# EAGLE design Adafruit AMG8833 FeatherWing (EAGLE 6.4)
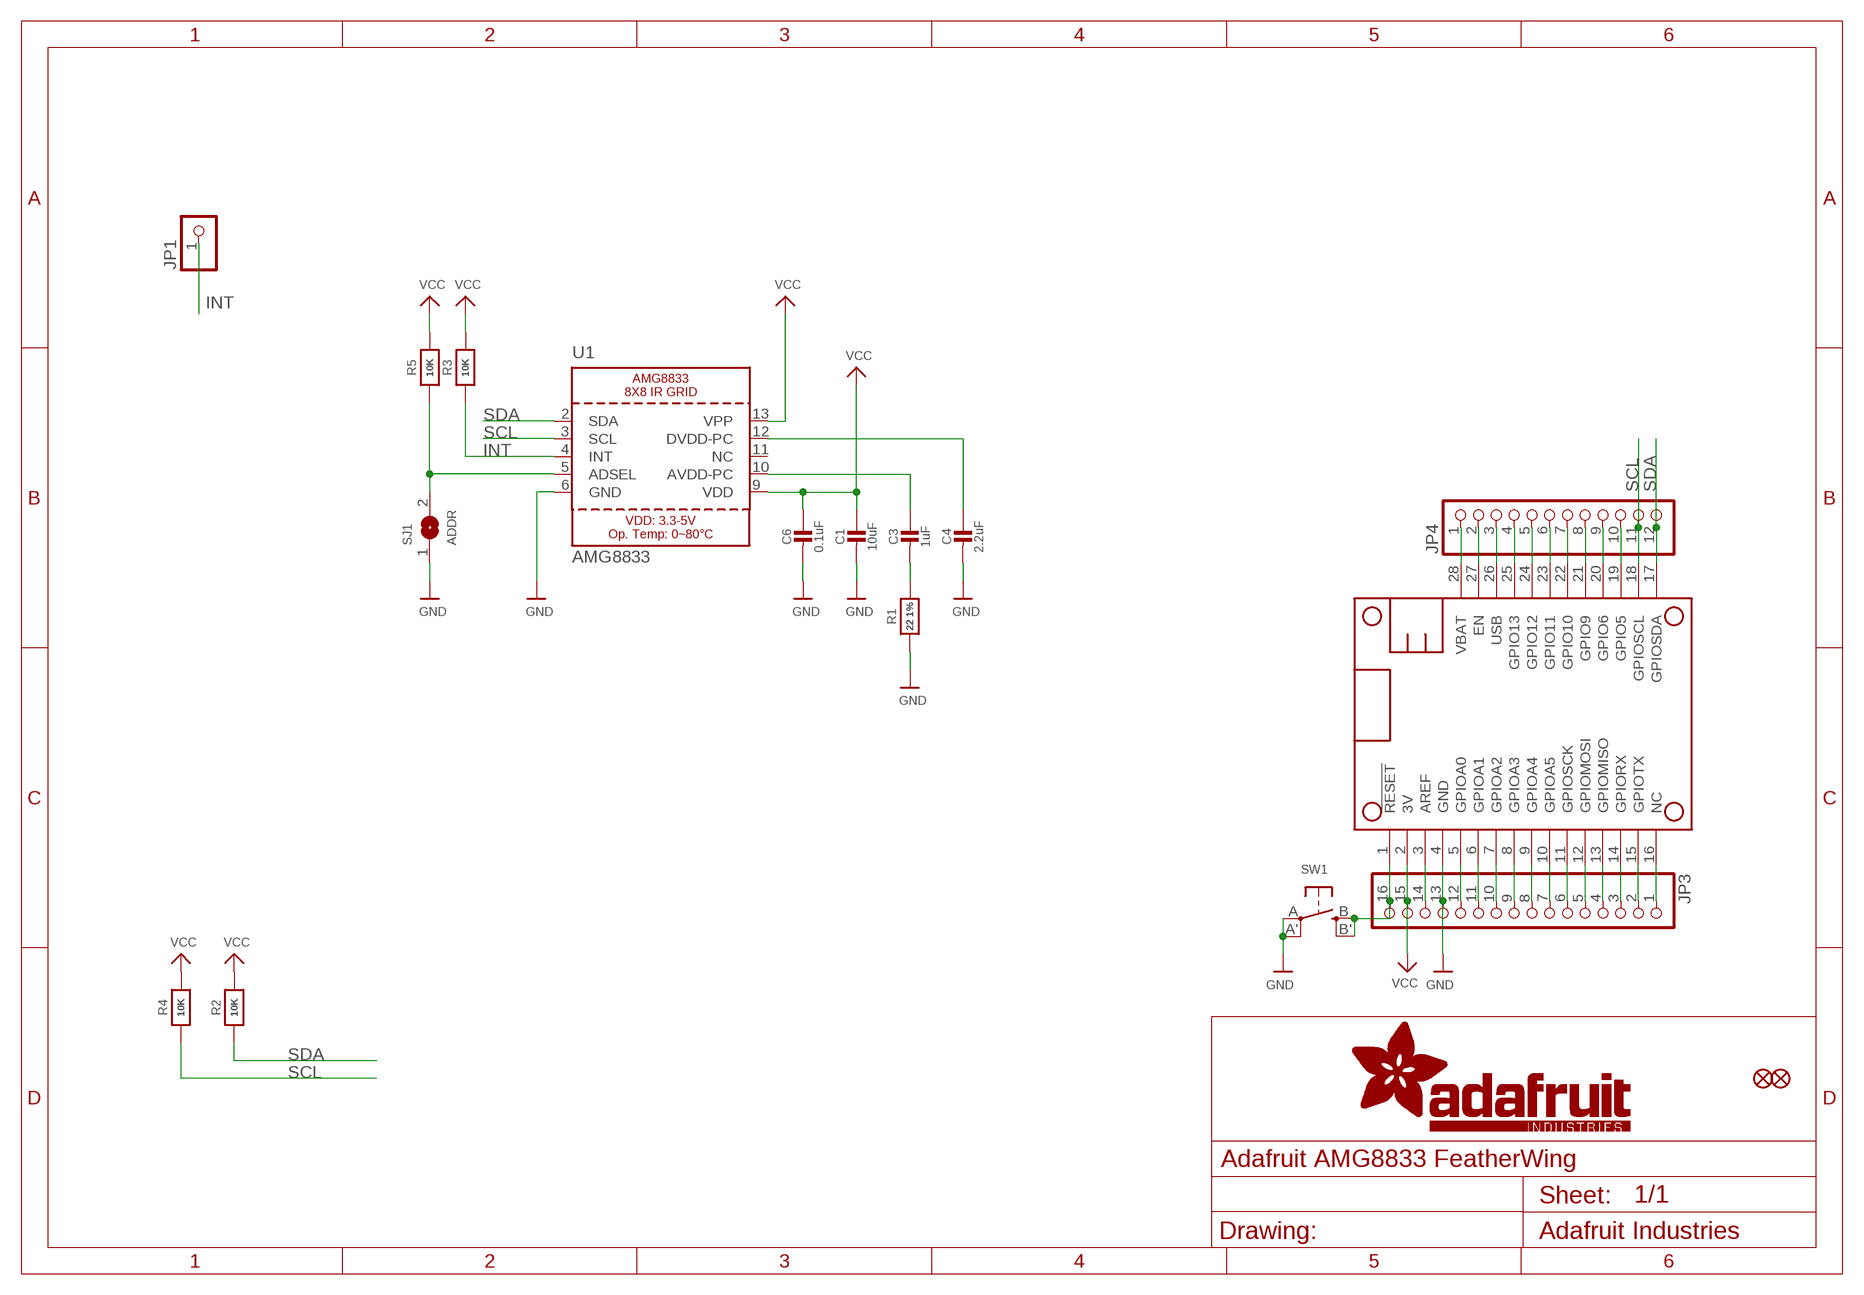
[diagram p0: schematic, sheet 1]

## Parts
C1  10uF  CAP_CERAMIC0805-NOOUTLINE  [0805-NO]
C3  1uF  CAP_CERAMIC0805-NOOUTLINE  [0805-NO]
C4  2.2uF  CAP_CERAMIC0805-NOOUTLINE  [0805-NO]
C6  0.1uF  CAP_CERAMIC0805-NOOUTLINE  [0805-NO]
FID1  FIDUCIAL""  [FIDUCIAL_1MM]
FID2  FIDUCIAL""  [FIDUCIAL_1MM]
JP1  HEADER-1X1ROUND  [1X01_ROUND]
JP3  HEADER-1X16ROUND  [1X16_ROUND]
JP4  HEADER-1X12  [1X12_ROUND]
MS1  FEATHERWING  [FEATHERWING]
R1  22 1%  RESISTOR0805_NOOUTLINE  [0805-NO]
R2  10K  RESISTOR0805_NOOUTLINE  [0805-NO]
R3  10K  RESISTOR0805_NOOUTLINE  [0805-NO]
R4  10K  RESISTOR0805_NOOUTLINE  [0805-NO]
R5  10K  RESISTOR0805_NOOUTLINE  [0805-NO]
SJ1  ADDR  SOLDERJUMPER  [SOLDERJUMPER_ARROW_NOPASTE]
SW1  SWITCH_TACT_SMT4.6X2.8  [BTN_KMR2_4.6X2.8]
U1  AMG8833  [AMG8833]

## Nets
A: JP3.12 MS1.5(GPIOA0)
AREF: JP3.14 MS1.3(AREF)
AVDD-PC1: C3.1 U1.10(AVDD-PC)
B: JP3.11 MS1.6(GPIOA1)
C: JP3.10 MS1.7(GPIOA2)
D: JP3.9 MS1.8(GPIOA3)
DVDD-PC1: C4.1 U1.12(DVDD-PC)
E: JP3.8 MS1.9(GPIOA4)
EN: JP4.2 MS1.27(EN)
F: JP3.7 MS1.10(GPIOA5)
G: JP3.1 MS1.16(NC)
GND: C1.2 C4.2 C6.2 JP3.13 MS1.4(GND) R1.1 SJ1.1 SW1.A'(P1) SW1.A(P) U1.6(GND)
H: JP4.10 MS1.19(GPIO5)
I: JP4.9 MS1.20(GPIO6)
INT: JP1.1 R3.1 U1.4(INT)
J: JP4.8 MS1.21(GPIO9)
K: JP4.7 MS1.22(GPIO10)
L: JP4.6 MS1.23(GPIO11)
M: JP4.5 MS1.24(GPIO12)
MISO: JP3.4 MS1.13(GPIOMISO)
MOSI: JP3.5 MS1.12(GPIOMOSI)
N: JP4.4 MS1.25(GPIO13)
N$2: R5.1 SJ1.2 U1.5(ADSEL)
N$4: C3.2 R1.2
RESET: JP3.16 MS1.1(!RESET) SW1.B'(S1) SW1.B(S)
RX: JP3.3 MS1.14(GPIORX)
SCK: JP3.6 MS1.11(GPIOSCK)
SCL: JP4.11 MS1.18(GPIOSCL) R4.1 U1.3(SCL)
SDA: JP4.12 MS1.17(GPIOSDA) R2.1 U1.2(SDA)
TX: JP3.2 MS1.15(GPIOTX)
USB: JP4.3 MS1.26(USB)
VBAT: JP4.1 MS1.28(VBAT)
VCC: C1.1 C6.1 JP3.15 MS1.2(3V) R2.2 R3.2 R4.2 R5.2 U1.9(VDD) U1.13(VPP)
Unconnected: U1.11(NC)

## Library data of the parts
C1 C3 C4 C6 = microbuilder:CAP_CERAMIC: Ceramic Capacitors For new designs, use the packages preceded by an '_' character since they are more reliable: The following footprints should be used on most boards: _0402 - Standard footprint for regular board layouts _0603 - Standard footprint for regular board layouts _0805 - Standard footprint for regular board layouts _1206 - Standard footprint for regular board layouts For extremely tight-pitch boards where space is at a premium, the following 'micro-pitch' footprints can be used (smaller pads, no silkscreen outline, etc.): _0402MP - Micro-pitch footprint for very dense/compact boards _0603MP - Micro-pitch footprint for very dense/compact boards _0805MP - Micro-pitch footprint for very dense/compact boards _1206MP - Micro-pitch footprint for very dense/compact boards
FID1 FID2 = microbuilder:FIDUCIAL: Fiducial Alignment Points Various fiducial points for machine vision alignment.; BOM: EXCLUDE
JP1 = microbuilder:HEADER-1X1: PIN HEADER
JP3 = microbuilder:HEADER-1X16: PIN HEADER
JP4 = microbuilder:HEADER-1X12
MS1 = microbuilder:FEATHERWING
R1-R5 = microbuilder:RESISTOR: Resistors For new designs, use the packages preceded by an '_' character since they are more reliable: The following footprints should be used on most boards: _0402 - Standard footprint for regular board layouts _0603 - Standard footprint for regular board layouts _0805 - Standard footprint for regular board layouts _1206 - Standard footprint for regular board layouts For extremely tight-pitch boards where space is at a premium, the following 'micro-pitch' footprints can be used (smaller pads, no silkscreen outline, etc.): _0402MP - Micro-pitch footprint for very dense/compact boards _0603MP - Micro-pitch footprint for very dense/compact boards _0805MP - Micro-pitch footprint for very dense/compact boards _1206MP - Micro-pitch footprint for very dense/compact boards
SJ1 = microbuilder:SOLDERJUMPER: SMD Solder JUMPER Solder the two pads together to create a connection, or remove the solder to break it. REFLOW - Use this footprint for solder paste and reflow ovens. WAVE - Use this footprint for hand-soldering (larger pads). CLOSED - Has a trace between the two pads to ensure it is closed by default. The trace needs to be cut to disable the jumper, and can be closed again by creating a solder bridge between the two pads.; BOM: EXCLUDE
SW1 = microbuilder:SWITCH_TACT_SMT: SMT Tact Switches 6x6mm - Digikey: P12940SCT-ND KMR2 (4.6x2.8mm) - Digikey: 401-1426-1-ND EVQ-PQHB55 - Light Touch, 160GF (4.5x4.5mm) - Digikey: P8090SCT-ND KMT0 - KMT021 NGJ LHS (etc.) IP68/Waterproof - Digikey: CKN10289CT-ND
U1 = microbuilder:AMG8833: AMG8833 8x8 IR Grid Sensor Viewing Angle: ~60° Temp Accuracy: +/-2-3°C (high/low gain)

## Board
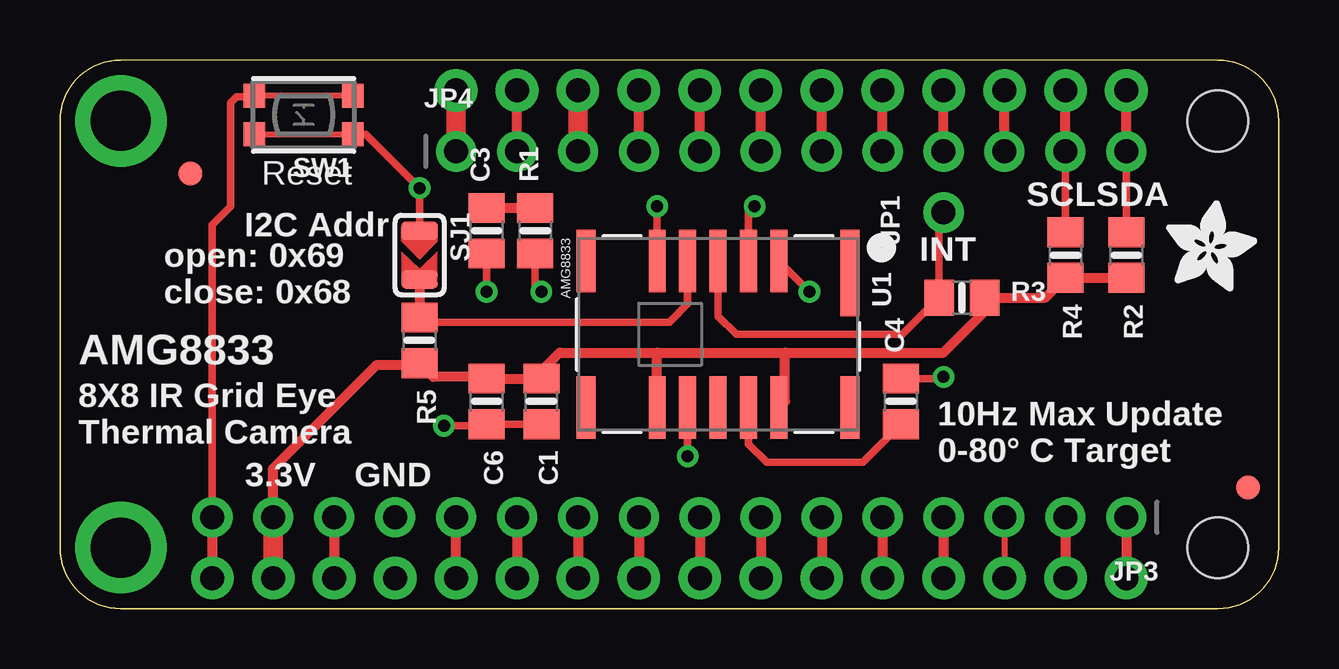
[diagram p1: board, top side]
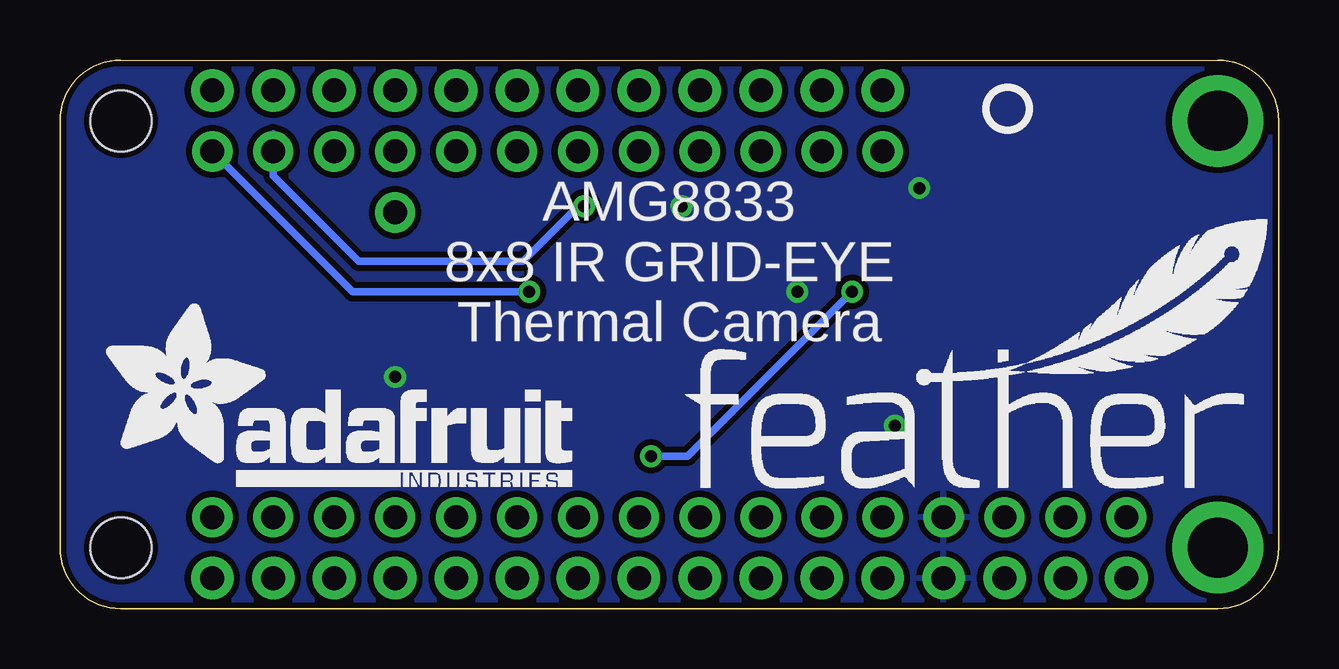
[diagram p2: board, bottom side, seen from below]

Size 50.8 x 22.86 mm. Coordinates in mm from the lower left corner, seen from the top.
Outline: 48.26,22.86 arc-90 50.8,20.32 50.8,2.54 arc-90 48.26,0 2.54,0 arc-90 0,2.54 0,20.32 arc-90 2.54,22.86
Copper layers (1*16): Top 0.035mm / dielectric 1.5mm / Bottom 0.035mm
Design rules "adafruit": minimum track width 8mil, minimum drill 15.5mil, track to track 8mil, track to pad 8mil, pad to pad 8mil, via to via 8mil, smd to smd 8mil, copper to edge 10mil, drill to drill 8mil, minimum pad ring 10mil, minimum via ring 8mil, stop-mask expansion 2mil, vias tented up to drill 20mil, thermal gap 10mil

### Footprints (pad centres in the part's own frame; a part is rotated, then mirrored left to right if it is on the bottom)
0805-NO = smd 1.24 x 1.5: 1 -0.95,0; 2 0.95,0
FIDUCIAL_1MM = smd 1 x 1: 1 0,0
1X01_ROUND = drill 1 pad 1.676: 1 0,0
1X16_ROUND = drill 1 pad 1.676: 1 -19.05,0; 2 -16.51,0; 3 -13.97,0; 4 -11.43,0; 5 -8.89,0; 6 -6.35,0; 7 -3.81,0; 8 -1.27,0; 9 1.27,0; 10 3.81,0; 11 6.35,0; 12 8.89,0; 13 11.43,0; 14 13.97,0; 15 16.51,0; 16 19.05,0
1X12_ROUND = drill 1 pad 1.676: 1 -13.97,0; 2 -11.43,0; 3 -8.89,0; 4 -6.35,0; 5 -3.81,0; 6 -1.27,0; 7 1.27,0; 8 3.81,0; 9 6.35,0; 10 8.89,0; 11 11.43,0; 12 13.97,0
FEATHERWING = drill 1 pad 1.778: 1 6.35,1.27; 2 8.89,1.27; 3 11.43,1.27; 4 13.97,1.27; 5 16.51,1.27; 6 19.05,1.27; 7 21.59,1.27; 8 24.13,1.27; 9 26.67,1.27; 10 29.21,1.27; 11 31.75,1.27; 12 34.29,1.27; 13 36.83,1.27; 14 39.37,1.27; 15 41.91,1.27; 16 44.45,1.27; 17 44.45,21.59; 18 41.91,21.59; 19 39.37,21.59; 20 36.83,21.59; 21 34.29,21.59; 22 31.75,21.59; 23 29.21,21.59; 24 26.67,21.59; 25 24.13,21.59; 26 21.59,21.59; 27 19.05,21.59; 28 16.51,21.59 | drill 2.5 pad 3.81: P$1 2.54,20.32; P$2 2.54,2.54 | hole 2.54: 48.26,20.32; 48.26,2.54
SOLDERJUMPER_ARROW_NOPASTE = smd 0.762 x 1.524: 1 -1.016,0; 2 1.016,0
BTN_KMR2_4.6X2.8 = smd 0.9 x 1: A 2.05,0.8; A' -2.05,0.8; B 2.05,-0.8; B' -2.05,-0.8
AMG8833 = smd 0.8 x 3.6: 1 -5.5,-2.55 | smd 0.7 x 2.6: 2 -2.54,-3.05; 3 -1.27,-3.05; 4 0,-3.05; 5 1.27,-3.05; 6 2.54,-3.05; 9 2.54,3.05; 10 1.27,3.05; 11 0,3.05; 12 -1.27,3.05; 13 -2.54,3.05 | smd 0.8 x 2.6: 7 5.5,-3.05; 8 5.5,3.05; 14 -5.5,3.05

### Placement (x,y rotation side)
C1  20.07,8.64 270 top
C3  17.78,15.75 90 top
C4  35.05,8.64 90 top
C6  17.78,8.64 270 top
FID1  5.45,18.13 0 top
FID2  49.53,5.05 0 top
JP1  36.83,16.51 90 top
JP3  25.4,3.81 180 top
JP4  30.48,19.05 0 top
MS1  0,0 0 top
R1  19.81,15.75 90 top
R2  44.45,14.73 270 top
R3  37.59,12.95 0 top
R4  41.91,14.73 270 top
R5  14.99,11.18 270 top
SJ1  14.99,14.73 270 top
SW1  10.16,20.57 180 top
U1  27.43,11.43 180 top
U$2  [ADAFRUIT_TEXT_20MM]  49.02,5.08 0 bottom
U$14  [ADAFRUIT_3.5MM]  46.1,13.21 0 top
U$15  [FEATHERLOGO]  24.77,4.95 0 bottom
U$16  [PCBFEAT-REV-040]  11.3,20.83 0 bottom

### Tracks (layer width: path | path; a pad name or v marks a point on that pad's centre or on a via)
A
  Top 0.406: MS1.5 JP3.12
AREF
  Top 0.406: JP3.14 MS1.3
AVDD-PC1  (via drill 0.5)
  Top 0.305: U1.10 v26.16,6.35 | v17.78,13.21 C3.1
  Bottom 0.305: v26.16,6.35 24.64,6.35 v17.78,13.21
B
  Top 0.406: JP3.11 MS1.6
C
  Top 0.406: JP3.10 MS1.7
D
  Top 0.406: JP3.9 MS1.8
DVDD-PC1
  Top 0.305: U1.12 28.7,6.86 29.46,6.1 33.46,6.1 C4.1
E
  Top 0.406: JP3.8 MS1.9
EN
  Top 0.406: JP4.2 MS1.27
F
  Top 0.406: JP3.7 MS1.10
G
  Top 0.406: JP3.1 MS1.16
GND  (via drill 0.5)
  Top 0.254: SW1.A SW1.A'
  Top 0.305: SJ1.1 v14.99,17.53 12.74,19.77 SW1.A' | R1.1 19.81,13.46 v20.07,13.21 | v16,7.62 17.71,7.62 C6.2 C1.2 | U1.6 v24.89,16.76 | C4.2 36.76,9.59 v36.83,9.65
  pour Bottom (isolate 0.254): 0,0 0,22.89 50.97,23.14 50.97,0
H
  Top 0.406: JP4.10 MS1.19
I
  Top 0.406: JP4.9 MS1.20
INT
  Top 0.305: U1.4 27.43,12.19 28.19,11.43 35.12,11.43 R3.1 36.64,16.32 JP1.1
J
  Top 0.406: JP4.8 MS1.21
K
  Top 0.406: JP4.7 MS1.22
L
  Top 0.406: JP4.6 MS1.23
M
  Top 0.406: JP4.5 MS1.24
MISO
  Top 0.406: JP3.4 MS1.13
MOSI
  Top 0.406: JP3.5 MS1.12
N
  Top 0.406: JP4.4 MS1.25
N$2
  Top 0.305: U1.5 26.16,12.7 25.4,11.94 15.17,11.94 R5.1
  Top 0.406: SJ1.2 R5.1
N$4
  Top 0.406: C3.2 R1.2
RESET
  Top 0.254: SW1.B' SW1.B
  Top 0.305: JP3.16 6.35,16 7.11,16.76 7.11,21.08 7.37,21.34 8.07,21.34 SW1.B
  Top 0.406: JP3.16 MS1.1
RX
  Top 0.254: JP3.3 MS1.14
SCK
  Top 0.406: JP3.6 MS1.11
SCL  (via drill 0.5)
  Top 0.305: U1.3 28.7,16.51 v28.96,16.76 | R4.1 JP4.11
  Top 0.406: JP4.11 MS1.18
  Bottom 0.254: 41.91,19.81 JP4.11
  Bottom 0.305: JP4.11 41.91,18.03 38.35,14.48 31.5,14.48 29.21,16.76 v28.96,16.76
SDA  (via drill 0.5)
  Top 0.305: JP4.12 R2.1 | U1.2 v31.24,13.21
  Top 0.406: JP4.12 MS1.17
  Bottom 0.305: v31.24,13.21 38.61,13.21 JP4.12
TX
  Top 0.406: JP3.2 MS1.15
USB
  Top 0.813: JP4.3 MS1.26
VBAT
  Top 0.813: JP4.1 MS1.28
VCC
  Top 0.406: 24.89,10.67 20.83,10.67 20.07,9.91 C1.1 C6.1 17.71,9.65 15.56,9.65 R5.2 14.92,10.16 13.21,10.16 8.89,5.84 JP3.15 | 24.89,10.67 30.23,10.67 | 30.23,10.67 36.83,10.67 38.61,12.45 38.61,13.14 R3.2 41.08,12.95 R4.2 R2.2 | U1.9 24.89,10.67 | U1.13 30.23,8.63 30.23,10.67
  Top 0.813: MS1.2 JP3.15

### Text on the board
tPlace: Reset | SCL | SDA | I2C Addr | open: 0x69 / close: 0x68 | INT | AMG8833 | 10Hz Max Update | 8X8 IR Grid Eye / Thermal Camera | 3.3V | GND | 0-80° C Target
bPlace: AMG8833 / 8x8 IR GRID-EYE / Thermal Camera